# Altium schematic sheet 3_power.SchDoc
size A4
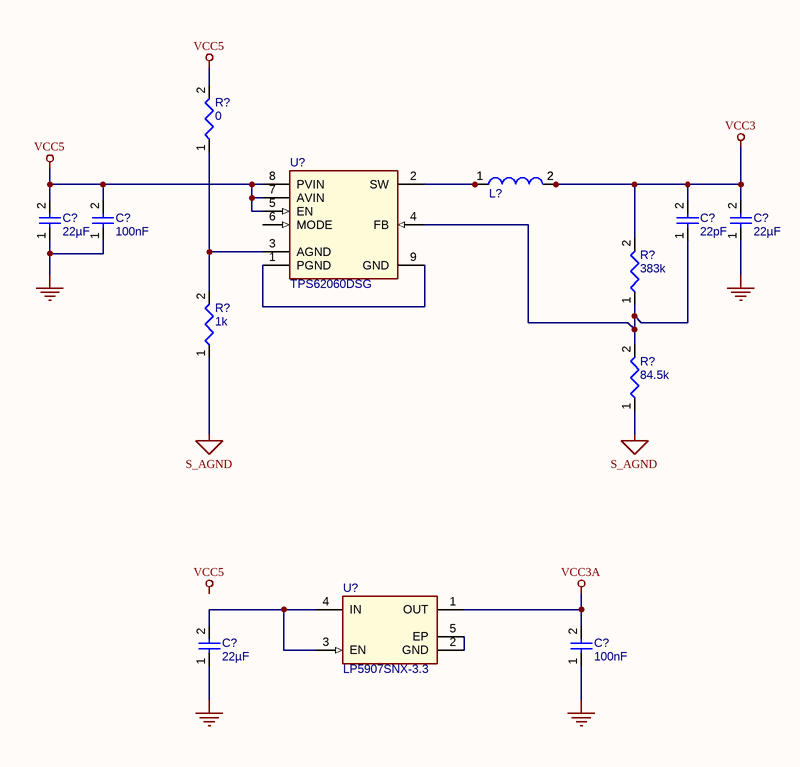
[diagram p0: 3_power.SchDoc]

## Parts
(Parts that share a designator on the sheet are numbered #1, #2 ... from top to bottom, then left to right.)
C?#1  value 22µF  [CAPC0805(2012)145_L]  (hidden comment: Capacitor 22µF +/-40% 16V 0805)
C?#2  value 100nF  [CAPC0402(1005)60_L]  (hidden comment: Capacitor 100nF +/-20% 10V 0402)
C?#3  value 22pF  [CAPC0402(1005)60_L]  (hidden comment: Capacitor 22pF +/-10% 50V 0402)
C?#4  value 22µF  [CAPC0805(2012)145_L]  (hidden comment: Capacitor 22µF +/-40% 16V 0805)
C?#5  value 22µF  [CAPC0805(2012)145_L]  (hidden comment: Capacitor 22µF +/-40% 16V 0805)
C?#6  value 100nF  [CAPC0402(1005)60_L]  (hidden comment: Capacitor 100nF +/-20% 10V 0402)
L?  VLS252010HBX-2R2M-1  [TDK-VLS252010_V]  (value not drawn)
R?#1  value 0  [RESC0402(1005)_L]  (hidden comment: Jumper 0402)
R?#2  value 383k  [RESC0402(1005)_L]  (hidden comment: Resistor 383K +/-1 % 0402 63 mW)
R?#3  value 1k  [RESC0402(1005)_L]  (hidden comment: Resistor 1K +/-5 % 0402 63 mW)
R?#4  value 84.5k  [RESC0402(1005)_L]  (hidden comment: Resistor 84K5 +/-1 % 0402 63 mW)
U?#1  TPS62060DSG  [DSG0008A_V]
U?#2  LP5907SNX-3.3  [TI-DQN4-480X480TP_V]

## Nets
GND: C?#1.1 C?#2.1 C?#4.1 C?#5.1 C?#6.1
S_AGND: R?#3.1 R?#4.1
VCC3: C?#3.2 C?#4.2 L?.2 R?#2.2
VCC3A: C?#6.2 U?#2.1(OUT)
VCC5: C?#1.2 C?#2.2 R?#1.2 U?#1.5(EN) U?#1.7(AVIN) U?#1.8(PVIN)
NetC?#3_1: C?#3.1 R?#2.1 R?#4.2 U?#1.4(FB)
NetC?#5_2: C?#5.2 U?#2.3(EN) U?#2.4(IN)
NetL?_1: L?.1 U?#1.2(SW)
NetR?#1_1: R?#1.1 R?#3.2 U?#1.3(AGND)
NetU?#1_1: U?#1.1(PGND) U?#1.9(GND)
NetU?#2_2: U?#2.2(GND) U?#2.5(EP)

Not connected (* = marked no-connect by the designer): U?#1 6(MODE)

## Notes on the sheet
- Labels drawn without touching a wire or pin: VCC5
- THIS DOCUMENT AND THE DATA DISCLOSED HEREIN OR
- HEREWITH IS THE PROPERTY OF ALTIUM LIMITED AND MAY
- DWG NO:
- REVISION
- REV:
- DESCRIPTION
- DATE
- APPROVED
- BE FREELY DISTRIBUTED IN WHOLE. NO RIGHTS ARE
- RESERVED OR EXPRESS OR IMPLIED WARANTEE GIVEN.
- ENG:
- APPROVALS
- PROJECT
- DSN:
- CHK:
- REFERENCE DOCUMENTS
- PROJECT REVISION:
- TITLE
- DOCUMENT REVISION:
- DESIGN ITEM:
- BOM:
- FAB DWG:
- PCB DWG:
- ASSY DWG:
- SCALE:
- A3
- SIZE
- CAGE CODE
- FILE NAME
- DWG NO.
- SHEET
- OF
- REV

## Library data of the parts
C?#1 C?#4 C?#5 = Capacitor 22µF +/-40% 16V 0805: Chip Capacitor, 22µF +/-40%, 16V, 0805, Thickness 1.45 mm; Manufacturer: Murata; Manufacturer Part Number: GRM21BR61C226ME44L; Tolerance: 5%; Voltage Rating: 16V; Case/Package: 0402; Pins: 2; Mounting Technology: SMT; Max Operating Temperature: 85°C; Min Operating Temperature: -55°C; Component Type: Capacitors
C?#2 C?#6 = Capacitor 100nF +/-20% 10V 0402: Chip Capacitor, 100nF +/-20%, 10V, 0402, Thickness 0.6 mm; Manufacturer: KEMET; Manufacturer Part Number: C0402C104K8RAC; Tolerance: 20%; Case/Package: 0402; Min Operating Temperature: -55°C; Mounting Technology: SMT; Max Operating Temperature: 85°C; Pins: 2; Voltage Rating: 10V; Component Type: Capacitors
C?#3 = Capacitor 22pF +/-10% 50V 0402: Chip Capacitor, 22pF +/-10%, 50V, 0402, Thickness 0.6 mm; Manufacturer: Kyocera AVX; Manufacturer Part Number: 04025A220JAT4A; Tolerance: 10%; Mounting Technology: SMT; Pins: 2; Voltage Rating: 50V; Case/Package: 0402; Max Operating Temperature: 85°C; Min Operating Temperature: -55°C; Component Type: Capacitors
L? = VLS252010HBX-2R2M-1: Inductor for Power Circuit, 2.2 uH, +/- 20%, -40 to 105 degC, 2-Pin SMD, RoHS, Tape and Reel; Manufacturer: TDK; Tolerance: 20%; Mounting Technology: SurfaceMount; Pins: 2; Manufacturer Part Number: VLS252010HBX-2R2M-1; Component Type: Inductors
R?#1 = Jumper 0402: Manufacturer: Yageo; Manufacturer Part Number: RC0402JR-070RL; Case/Package: 0402; Max Operating Temperature: 155°C; Min Operating Temperature: -55°C; Pins: 2; Component Type: Resistors
R?#2 = Resistor 383K +/-1 % 0402 63 mW: Chip Resistor, 383 kOhms, +/-1 %, 63 mW, -55 to 155 degC, 0402; Manufacturer: Vishay; Manufacturer Part Number: CRCW0402383KFKED; Tolerance: 1%; Power: 63mW; Case/Package: 0402; Max Operating Temperature: 155°C; Min Operating Temperature: -55°C; Pins: 2; Component Type: Resistors
R?#3 = Resistor 1K +/-5 % 0402 63 mW: Chip Resistor, 1 kOhms, +/-5 %, 63 mW, -55 to 155 degC, 0402; Manufacturer: Yageo; Manufacturer Part Number: RC0402JR-071KL; Tolerance: 5%; Power: 63mW; Case/Package: 0402; Max Operating Temperature: 155°C; Min Operating Temperature: -55°C; Pins: 2; Component Type: Resistors
R?#4 = Resistor 84K5 +/-1 % 0402 63 mW: Chip Resistor, 84,5 kOhms, +/-1 %, 63 mW, -55 to 155 degC, 0402; Manufacturer: Vishay Dale; Manufacturer Part Number: CRCW040284K5FKTD; Tolerance: 1%; Power: 63mW; Case/Package: 0402; Max Operating Temperature: 155°C; Min Operating Temperature: -55°C; Pins: 2; Component Type: Resistors
U?#1 = TPS62060DSG: Step Down Converter, 3 MHz, 1.6 A, -45 to 85 degC, 8-Pin WSON, RoHS, Tape and Reel; Manufacturer: Texas Instruments; Manufacturer Part Number: TPS62060DSGR; Pins: 9; Component Type: Power Supply
U?#2 = LP5907SNX-3.3: Ultra-Low-Noise, Low-IQ LDO, 3.3 V, 0.25 A, -40 to 125 degC, 4-Pin X2SON, RoHS, Tape and Reel; Manufacturer: Texas Instruments; Manufacturer Part Number: LP5907SNX-3.3/NOPB; Output Voltage: 3.3V; Min Operating Temperature: -40°C; Pins: 5; Max Operating Temperature: 125°C; Component Type: Power Supply